# Altium schematic sheet Snippet of Dev.SchDoc
size 292 x 193 mm
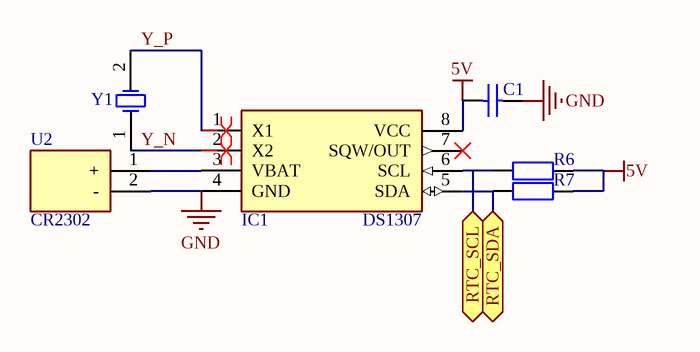
[diagram p0: Snippet of Dev.SchDoc]

## Parts
C1  100nF  [CAP-0603]  (value not drawn)
IC1  DS1307  [SOIC_8]
R6  4.7K  [R-0603]  (value not drawn)
R7  4.7K  [R-0603]  (value not drawn)
U2  CR2302  [CR2032-1]
Y1  32.768KHz ±20ppm 12.5pF  [SMD-3215_2P FC - 135]  (value not drawn)

## Ports
RTC_SCL (bidir), RTC_SDA (bidir)

## Nets
5V: C1.1 IC1.8(VCC) R6.2 R7.2
GND: C1.2 IC1.4(GND) U2.2(-)
RTC_SCL: IC1.6(SCL) R6.1 ; port RTC_SCL
RTC_SDA: IC1.5(SDA) R7.1 ; port RTC_SDA
Y_N: IC1.2(X2) Y1.1(OSC1)
Y_P: IC1.1(X1) Y1.2(OSC2)
NetIC1_3: IC1.3(VBAT) U2.1(+)

Not connected (* = marked no-connect by the designer): IC1 7(SQW/OUT)*

## Layout directives
differential pair: Y_N, Y_P

## Library data of the parts
C1 = CAP: 贴片电容; ComponentLink1Description: 供应商链接; ComponentLink1URL: http://www.szlcsc.com/product/details_53938.html; Package: 0402; Supplier: LC; SuppliersPartNumber: C52923
IC1 = DS1307: Integrated Circuit; Manufacturer_Name: Maxim Integrated; Manufacturer_Part_Number: DS1307+; Datasheet Link: http://datasheets.maximintegrated.com/en/ds/DS1307.pdf; Height: 4.572mm; Mouser Part Number: 700-DS1307; Mouser Price/Stock: https://www.mouser.com/Search/Refine.aspx?Keyword=700-DS1307; RS Part Number: 1898457; RS Price/Stock: http://uk.rs-online.com/web/p/products/1898457
R6 R7 = RES: 贴片电阻; Package: 0805; Supplier: LC; SuppliersPartNumber: C17798
U2 = BAT: 锂电池; Manufacturer_Name: Keystone Electronics; Manufacturer_Part_Number: 1026; Allied_Number: 70182086; Datasheet Link: http://www.keyelco.com/product-pdf.cfm?p=721; Mouser Part Number: 534-1026; Mouser Price/Stock: https://www.mouser.com/Search/Refine.aspx?Keyword=534-1026; RS Part Number: 1142133; RS Price/Stock: http://uk.rs-online.com/web/p/products/1142133; Allied Price/Stock: http://www.alliedelec.com/keystone-electronics-1026/70182086/
Y1 = Crystal: 无源晶振; ComponentLink1Description: 供应商链接; ComponentLink1URL: http://www.szlcsc.com/product/details_33310.html; Package: SMD-3215_2P; Supplier: LC; SuppliersPartNumber: C32346